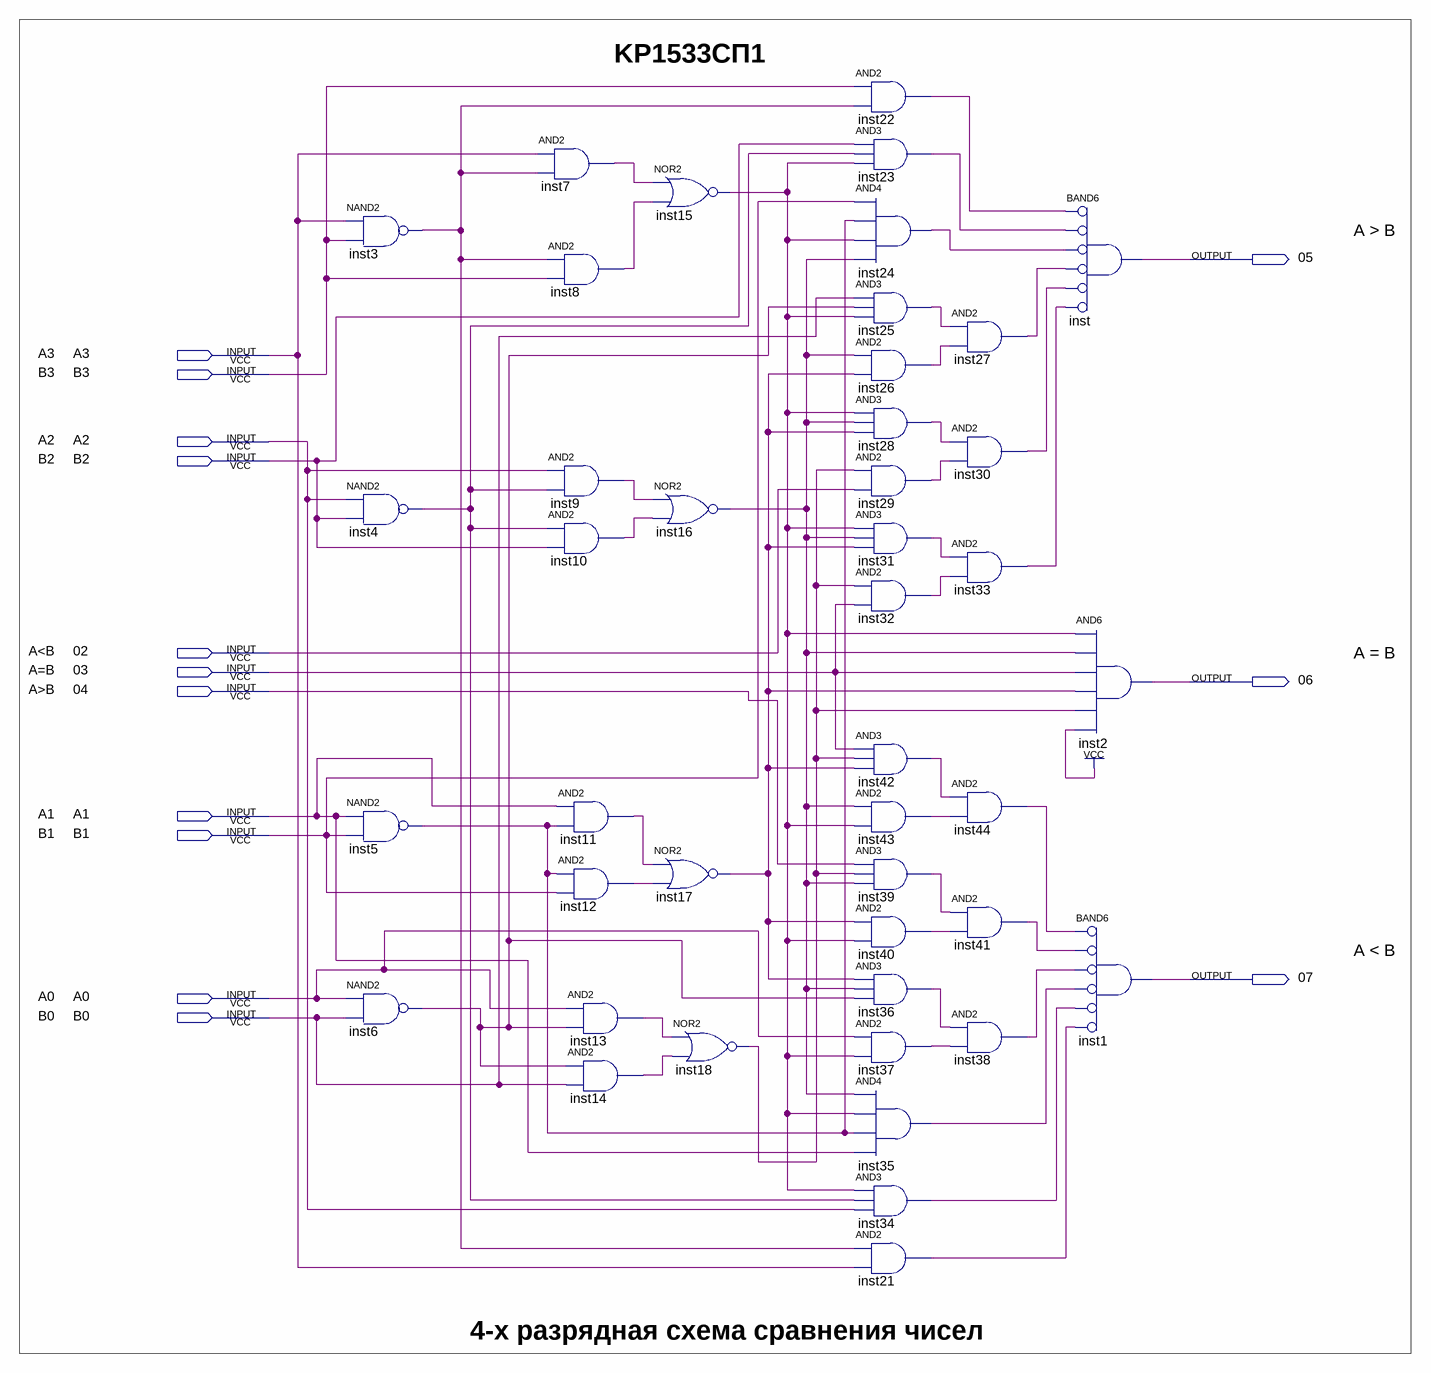
[diagram p0: schematic sheet]
// Quartus schematic KP1533SP1.bdf as structural Verilog: 43 symbols, 14 pins
module KP1533SP1 (
  input  A3,
  input  B3,
  input  A2,
  input  B2,
  input  \02 ,
  input  \03 ,
  input  \04 ,
  input  A1,
  input  B1,
  input  A0,
  input  B0,
  output \05 ,
  output \06 ,
  output \07 
);

  wire inst3_out, inst4_out, inst5_out, inst6_out, inst7_out, inst8_out, inst9_out, inst10_out, inst11_out,
       inst12_out, inst13_out, inst14_out, inst15_out, inst16_out, inst17_out, inst18_out, inst21_out,
       inst22_out, inst23_out, inst24_out, inst25_out, inst26_out, inst27_out, inst28_out, inst29_out,
       inst30_out, inst31_out, inst32_out, inst33_out, inst34_out, inst35_out, inst36_out, inst37_out,
       inst38_out, inst39_out, inst40_out, inst41_out, inst42_out, inst43_out, inst44_out;

  nand inst3 (inst3_out, A3, B3);
  nand inst4 (inst4_out, A2, B2);
  nand inst5 (inst5_out, A1, B1);
  nand inst6 (inst6_out, A0, B0);
  and inst7 (inst7_out, A3, inst3_out);
  and inst8 (inst8_out, inst3_out, B3);
  and inst9 (inst9_out, A2, inst4_out);
  and inst10 (inst10_out, inst4_out, B2);
  and inst11 (inst11_out, A1, inst5_out);
  and inst12 (inst12_out, inst5_out, B1);
  and inst13 (inst13_out, A0, inst6_out);
  and inst14 (inst14_out, inst6_out, B0);
  nor inst15 (inst15_out, inst7_out, inst8_out);
  nor inst16 (inst16_out, inst9_out, inst10_out);
  nor inst17 (inst17_out, inst11_out, inst12_out);
  nor inst18 (inst18_out, inst13_out, inst14_out);
  and inst22 (inst22_out, B3, inst3_out);
  and inst23 (inst23_out, B2, inst4_out, inst15_out);
  and inst24 (inst24_out, B1, inst5_out, inst15_out, inst16_out);
  and inst25 (inst25_out, B0, inst6_out, inst15_out);
  and inst26 (inst26_out, inst16_out, inst17_out);
  and inst28 (inst28_out, inst15_out, inst16_out, inst17_out);
  and inst29 (inst29_out, inst18_out, \02 );
  and inst31 (inst31_out, inst15_out, inst16_out, inst17_out);
  and inst32 (inst32_out, inst18_out, \03 );
  and inst42 (inst42_out, \03 , inst18_out, inst17_out);
  and inst43 (inst43_out, inst16_out, inst15_out);
  and inst39 (inst39_out, \04 , inst18_out, inst16_out);
  and inst40 (inst40_out, inst17_out, inst15_out);
  and inst36 (inst36_out, inst17_out, inst16_out, inst6_out);
  and inst37 (inst37_out, A0, inst15_out);
  and inst35 (inst35_out, inst16_out, inst15_out, inst5_out, A1);
  and inst34 (inst34_out, inst15_out, inst4_out, A2);
  and inst21 (inst21_out, inst3_out, A3);
  and inst27 (inst27_out, inst25_out, inst26_out);
  and inst30 (inst30_out, inst28_out, inst29_out);
  and inst33 (inst33_out, inst31_out, inst32_out);
  and inst44 (inst44_out, inst42_out, inst43_out);
  and inst41 (inst41_out, inst39_out, inst40_out);
  and inst38 (inst38_out, inst36_out, inst37_out);
  and inst (\05 , ~inst22_out, ~inst23_out, ~inst24_out, ~inst27_out, ~inst30_out, ~inst33_out);  // BAND6
  and inst2 (\06 , inst15_out, inst16_out, \03 , inst17_out, inst18_out, 1'b1);
  and inst1 (\07 , ~inst44_out, ~inst41_out, ~inst38_out, ~inst35_out, ~inst34_out, ~inst21_out);  // BAND6

  // Notes on the sheet:
  //   KP1533СП1
  //   A > B
  //   A3
  //   B3
  //   A2
  //   B2
  //   A<B
  //   A = B
  //   A=B
  //   A>B
  //   A1
  //   B1
  //   A < B
  //   A0
  //   B0
  //   4-х разрядная схема сравнения чисел
endmodule
